# Altium schematic sheet Ethernet.SchDoc
size A3
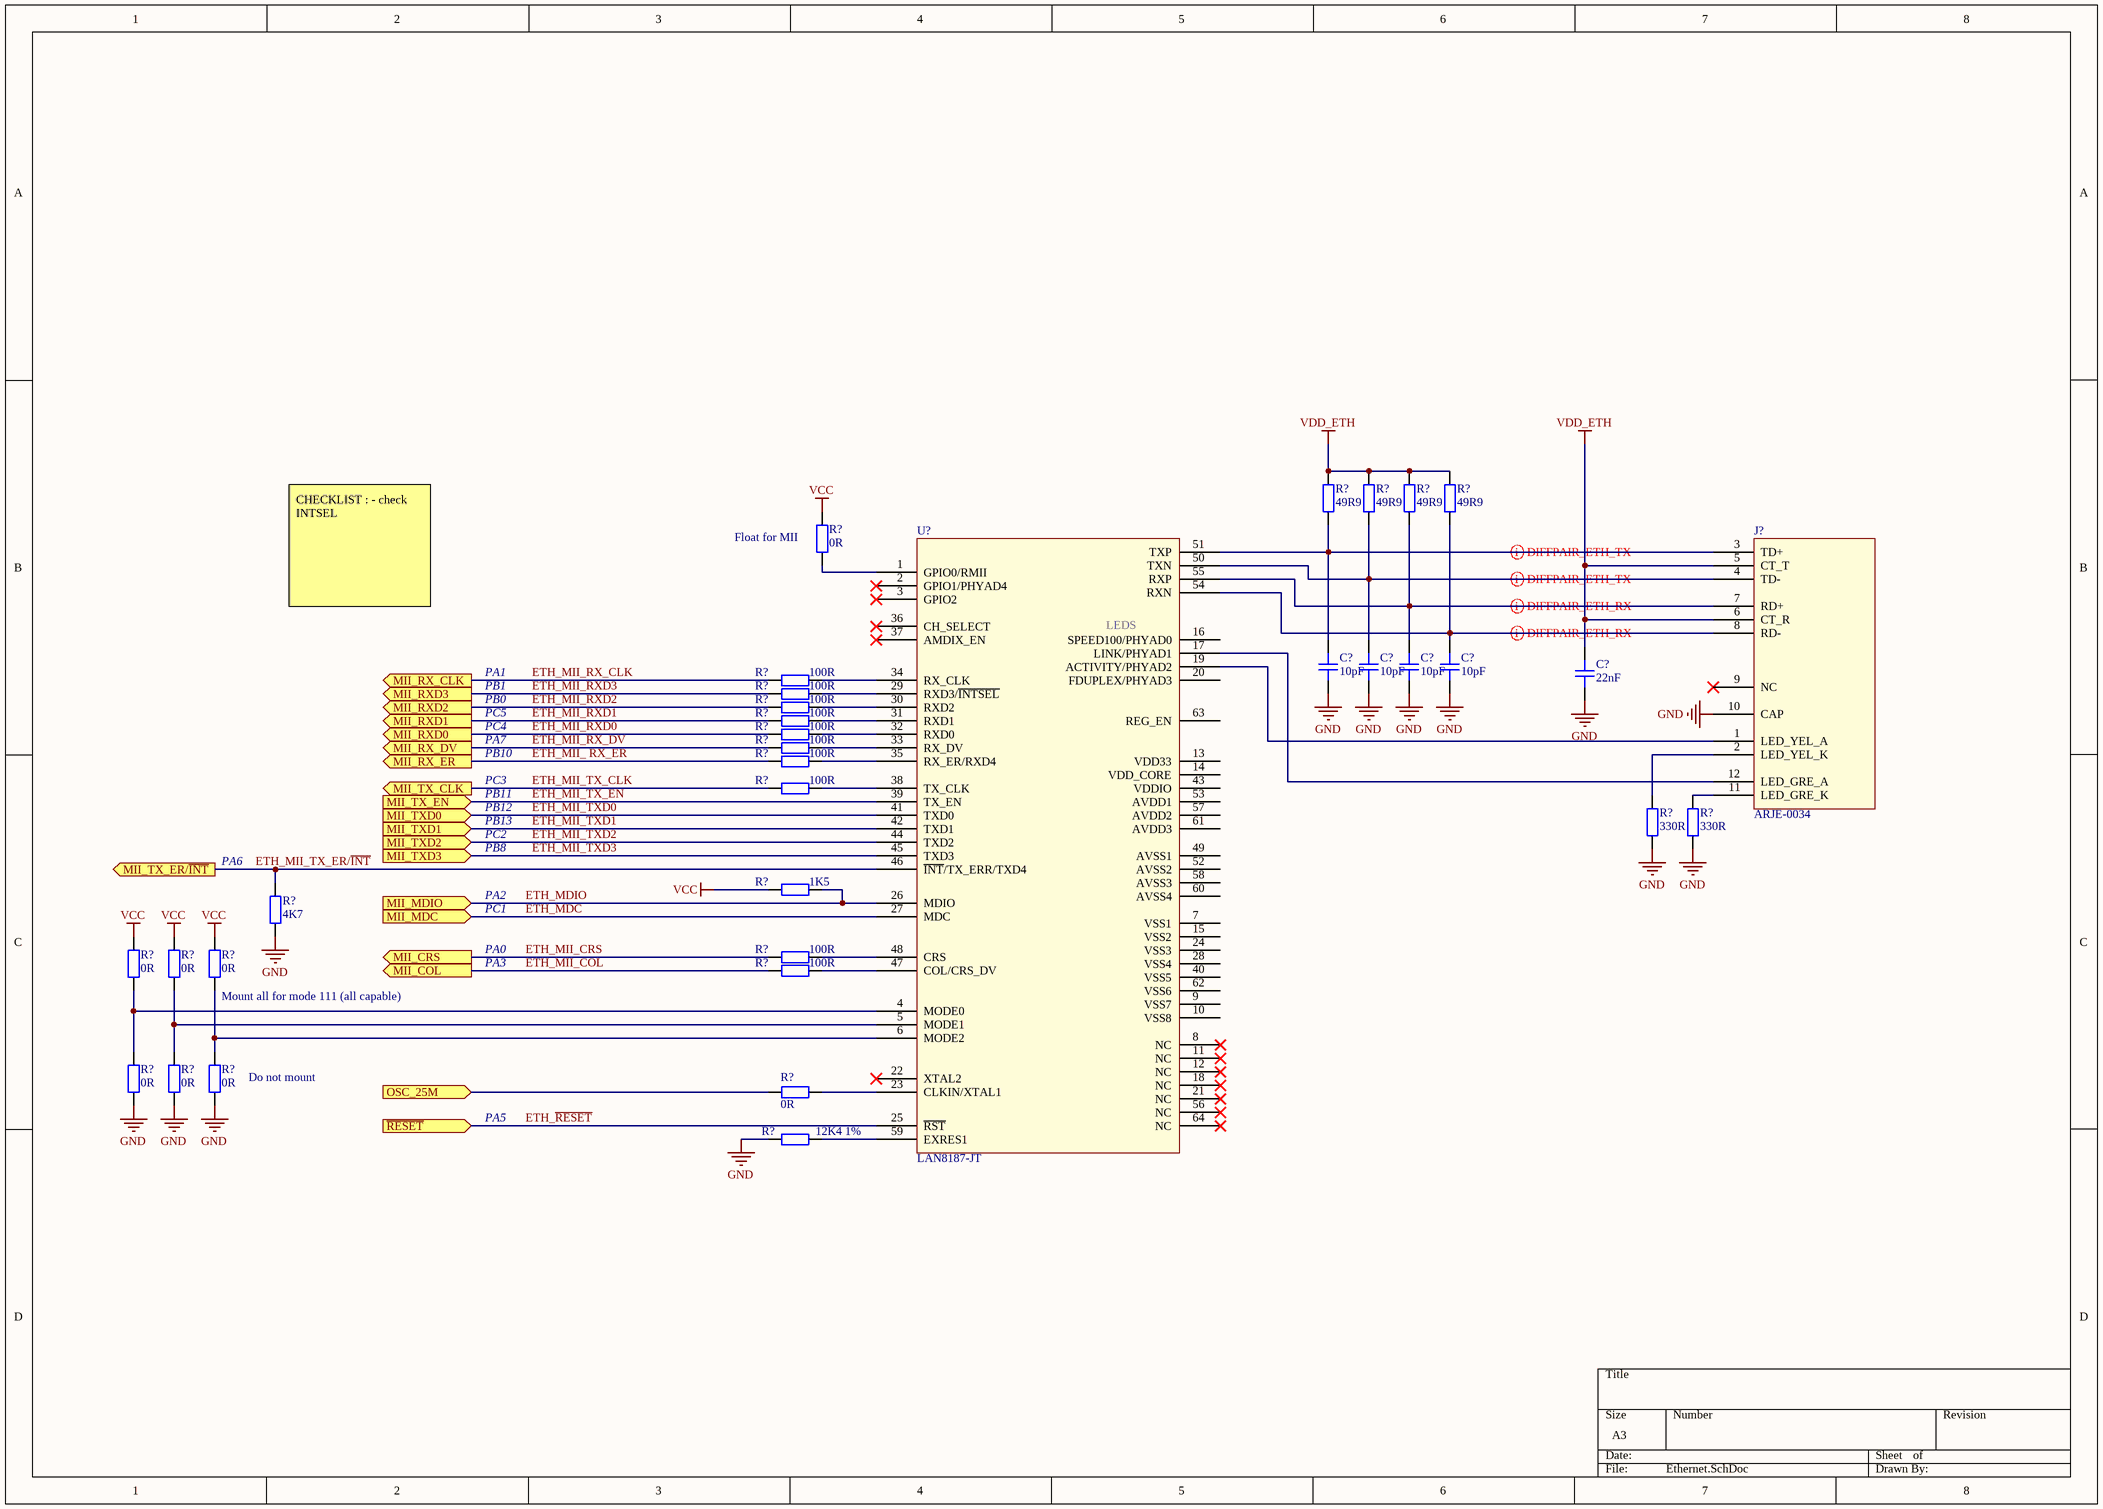
[diagram p0: Ethernet.SchDoc]

## Parts
(Parts that share a designator on the sheet are numbered #1, #2 ... from top to bottom, then left to right.)
C?#1  value 10pF  (hidden comment: C-10pF-0603)
C?#2  value 10pF  (hidden comment: C-10pF-0603)
C?#3  value 10pF  (hidden comment: C-10pF-0603)
C?#4  value 10pF  (hidden comment: C-10pF-0603)
C?#5  value 22nF  (hidden comment: C-22nF-0603)
J?  ARJE-0034
R?#1  value 49R9  (hidden comment: R-49R9-0603)
R?#2  value 49R9  (hidden comment: R-49R9-0603)
R?#3  value 49R9  (hidden comment: R-49R9-0603)
R?#4  value 49R9  (hidden comment: R-49R9-0603)
R?#5  value 0R  (hidden comment: R-0R-0603)
R?#6  value 100R  (hidden comment: R-100R-0603)
R?#7  value 100R  (hidden comment: R-100R-0603)
R?#8  value 100R  (hidden comment: R-100R-0603)
R?#9  value 100R  (hidden comment: R-100R-0603)
R?#10  value 100R  (hidden comment: R-100R-0603)
R?#11  value 100R  (hidden comment: R-100R-0603)
R?#12  value 100R  (hidden comment: R-100R-0603)
R?#13  value 100R  (hidden comment: R-100R-0603)
R?#14  value 330R  (hidden comment: R-330R-0603)
R?#15  value 330R  (hidden comment: R-330R-0603)
R?#16  value 1K5  (hidden comment: R-1K5-0603)
R?#17  value 4K7  (hidden comment: R-4K7-0603)
R?#18  value 100R  (hidden comment: R-100R-0603)
R?#19  value 0R  (hidden comment: R-0R-0603)
R?#20  value 0R  (hidden comment: R-0R-0603)
R?#21  value 0R  (hidden comment: R-0R-0603)
R?#22  value 100R  (hidden comment: R-100R-0603)
R?#23  value 0R  (hidden comment: R-0R-0603)
R?#24  value 0R  (hidden comment: R-0R-0603)
R?#25  value 0R  (hidden comment: R-0R-0603)
R?#26  value 0R  (hidden comment: R-0R-0603)
R?#27  value 12K4 1%  (hidden comment: R-12K4-1%-0603)
U?  LAN8187-JT

## Ports
MII_COL (out), MII_CRS (out), MII_MDC (in), MII_MDIO (in), MII_RX_CLK (out), MII_RX_DV (out), MII_RX_ER (out), MII_RXD0 (out), MII_RXD1 (out), MII_RXD2 (out), MII_RXD3 (out), MII_TX_CLK (out), MII_TX_EN (in), MII_TX_ER/~{INT} (out), MII_TXD0 (in), MII_TXD1 (in), MII_TXD2 (in), MII_TXD3 (in), OSC_25M (in), ~{RESET} (in)

## Nets
GND: C?#1.1 C?#2.1 C?#3.1 C?#4.1 C?#5.1 J?.10(CAP) R?#14.1 R?#15.1 R?#17.1 R?#23.1 R?#24.1 R?#25.1 R?#27.1
VCC: R?#5.2 R?#16.1 R?#19.2 R?#20.2 R?#21.2
VDD_ETH: C?#5.2 J?.5(CT_T) J?.6(CT_R) R?#1.2 R?#2.2 R?#3.2 R?#4.2
ETH_MDC: U?.27(MDC) ; port MII_MDC
ETH_MDIO: R?#16.2 U?.26(MDIO) ; port MII_MDIO
ETH_MII_ RX_ER: R?#12.1 ; port MII_RX_ER
ETH_MII_COL: R?#22.1 ; port MII_COL
ETH_MII_CRS: R?#18.1 ; port MII_CRS
ETH_MII_RX_CLK: R?#6.1 ; port MII_RX_CLK
ETH_MII_RX_DV: R?#11.1 ; port MII_RX_DV
ETH_MII_RXD0: R?#10.1 ; port MII_RXD0
ETH_MII_RXD1: R?#9.1 ; port MII_RXD1
ETH_MII_RXD2: R?#8.1 ; port MII_RXD2
ETH_MII_RXD3: R?#7.1 ; port MII_RXD3
ETH_MII_TX_CLK: R?#13.1 ; port MII_TX_CLK
ETH_MII_TX_EN: U?.39(TX_EN) ; port MII_TX_EN
ETH_MII_TX_ER/~{INT}: R?#17.2 U?.46(~{INT}/TX_ERR/TXD4) ; port MII_TX_ER/~{INT}
ETH_MII_TXD0: U?.41(TXD0) ; port MII_TXD0
ETH_MII_TXD1: U?.42(TXD1) ; port MII_TXD1
ETH_MII_TXD2: U?.44(TXD2) ; port MII_TXD2
ETH_MII_TXD3: U?.45(TXD3) ; port MII_TXD3
ETH_~{RESET}: U?.25(~{RST}) ; port ~{RESET}
OSC_25M: R?#26.1 ; port OSC_25M
NetC?#1_2: C?#1.2 J?.3(TD+) R?#1.1 U?.51(TXP)
NetC?#2_2: C?#2.2 J?.4(TD-) R?#2.1 U?.50(TXN)
NetC?#3_2: C?#3.2 J?.7(RD+) R?#3.1 U?.55(RXP)
NetC?#4_2: C?#4.2 J?.8(RD-) R?#4.1 U?.54(RXN)
NetJ?_1: J?.1(LED_YEL_A) U?.19(ACTIVITY/PHYAD2)
NetJ?_2: J?.2(LED_YEL_K) R?#14.2
NetJ?_11: J?.11(LED_GRE_K) R?#15.2
NetJ?_12: J?.12(LED_GRE_A) U?.17(LINK/PHYAD1)
NetR?#5_1: R?#5.1 U?.1(GPIO0/RMII)
NetR?#6_2: R?#6.2 U?.34(RX_CLK)
NetR?#7_2: R?#7.2 U?.29(RXD3/~{INTSEL})
NetR?#8_2: R?#8.2 U?.30(RXD2)
NetR?#9_2: R?#9.2 U?.31(RXD1)
NetR?#10_2: R?#10.2 U?.32(RXD0)
NetR?#11_2: R?#11.2 U?.33(RX_DV)
NetR?#12_2: R?#12.2 U?.35(RX_ER/RXD4)
NetR?#13_2: R?#13.2 U?.38(TX_CLK)
NetR?#18_2: R?#18.2 U?.48(CRS)
NetR?#19_1: R?#19.1 R?#23.2 U?.4(MODE0)
NetR?#20_1: R?#20.1 R?#24.2 U?.5(MODE1)
NetR?#21_1: R?#21.1 R?#25.2 U?.6(MODE2)
NetR?#22_2: R?#22.2 U?.47(COL/CRS_DV)
NetR?#26_2: R?#26.2 U?.23(CLKIN/XTAL1)
NetR?#27_2: R?#27.2 U?.59(EXRES1)

Not connected (* = marked no-connect by the designer): J? 9(NC)*; U? 2(GPIO1/PHYAD4)* 3(GPIO2)* 7(VSS1) 8(NC)* 9(VSS7) 10(VSS8) 11(NC)* 12(NC)* 13(VDD33) 14(VDD_CORE) 15(VSS2) 16(SPEED100/PHYAD0) 18(NC)* 20(FDUPLEX/PHYAD3) 21(NC)* 22(XTAL2)* 24(VSS3) 28(VSS4) 36(CH_SELECT)* 37(AMDIX_EN)* 40(VSS5) 43(VDDIO) 49(AVSS1) 52(AVSS2) 53(AVDD1) 56(NC)* 57(AVDD2) 58(AVSS3) 60(AVSS4) 61(AVDD3) 62(VSS6) 63(REG_EN) 64(NC)*

## Layout directives
differential pair: NetC?#1_2, NetC?#2_2, NetC?#3_2, NetC?#4_2

## Notes on the sheet
- (near R?#5) Float for MII
- CHECKLIST : - check INTSEL
- PA1
- PB1
- PB0
- PC5
- PC4
- PA7
- PB10
- PC3
- PB11
- PB12
- PB13
- PC2
- PB8
- (near R?#17) PA6
- PA2
- PC1
- PA0
- PA3
- (near R?#21) Mount all for mode 111 (all capable)
- (near R?#25) Do not mount
- PA5
- (in symbol LAN8187-JT) LEDS

## Library data of the parts
J? = ARJE-0034: Supplier 1: Digi-Key; Supplier Part Number 1: 535-12443-1-ND